# Altium project Kurs_2025_1.PrjPcb
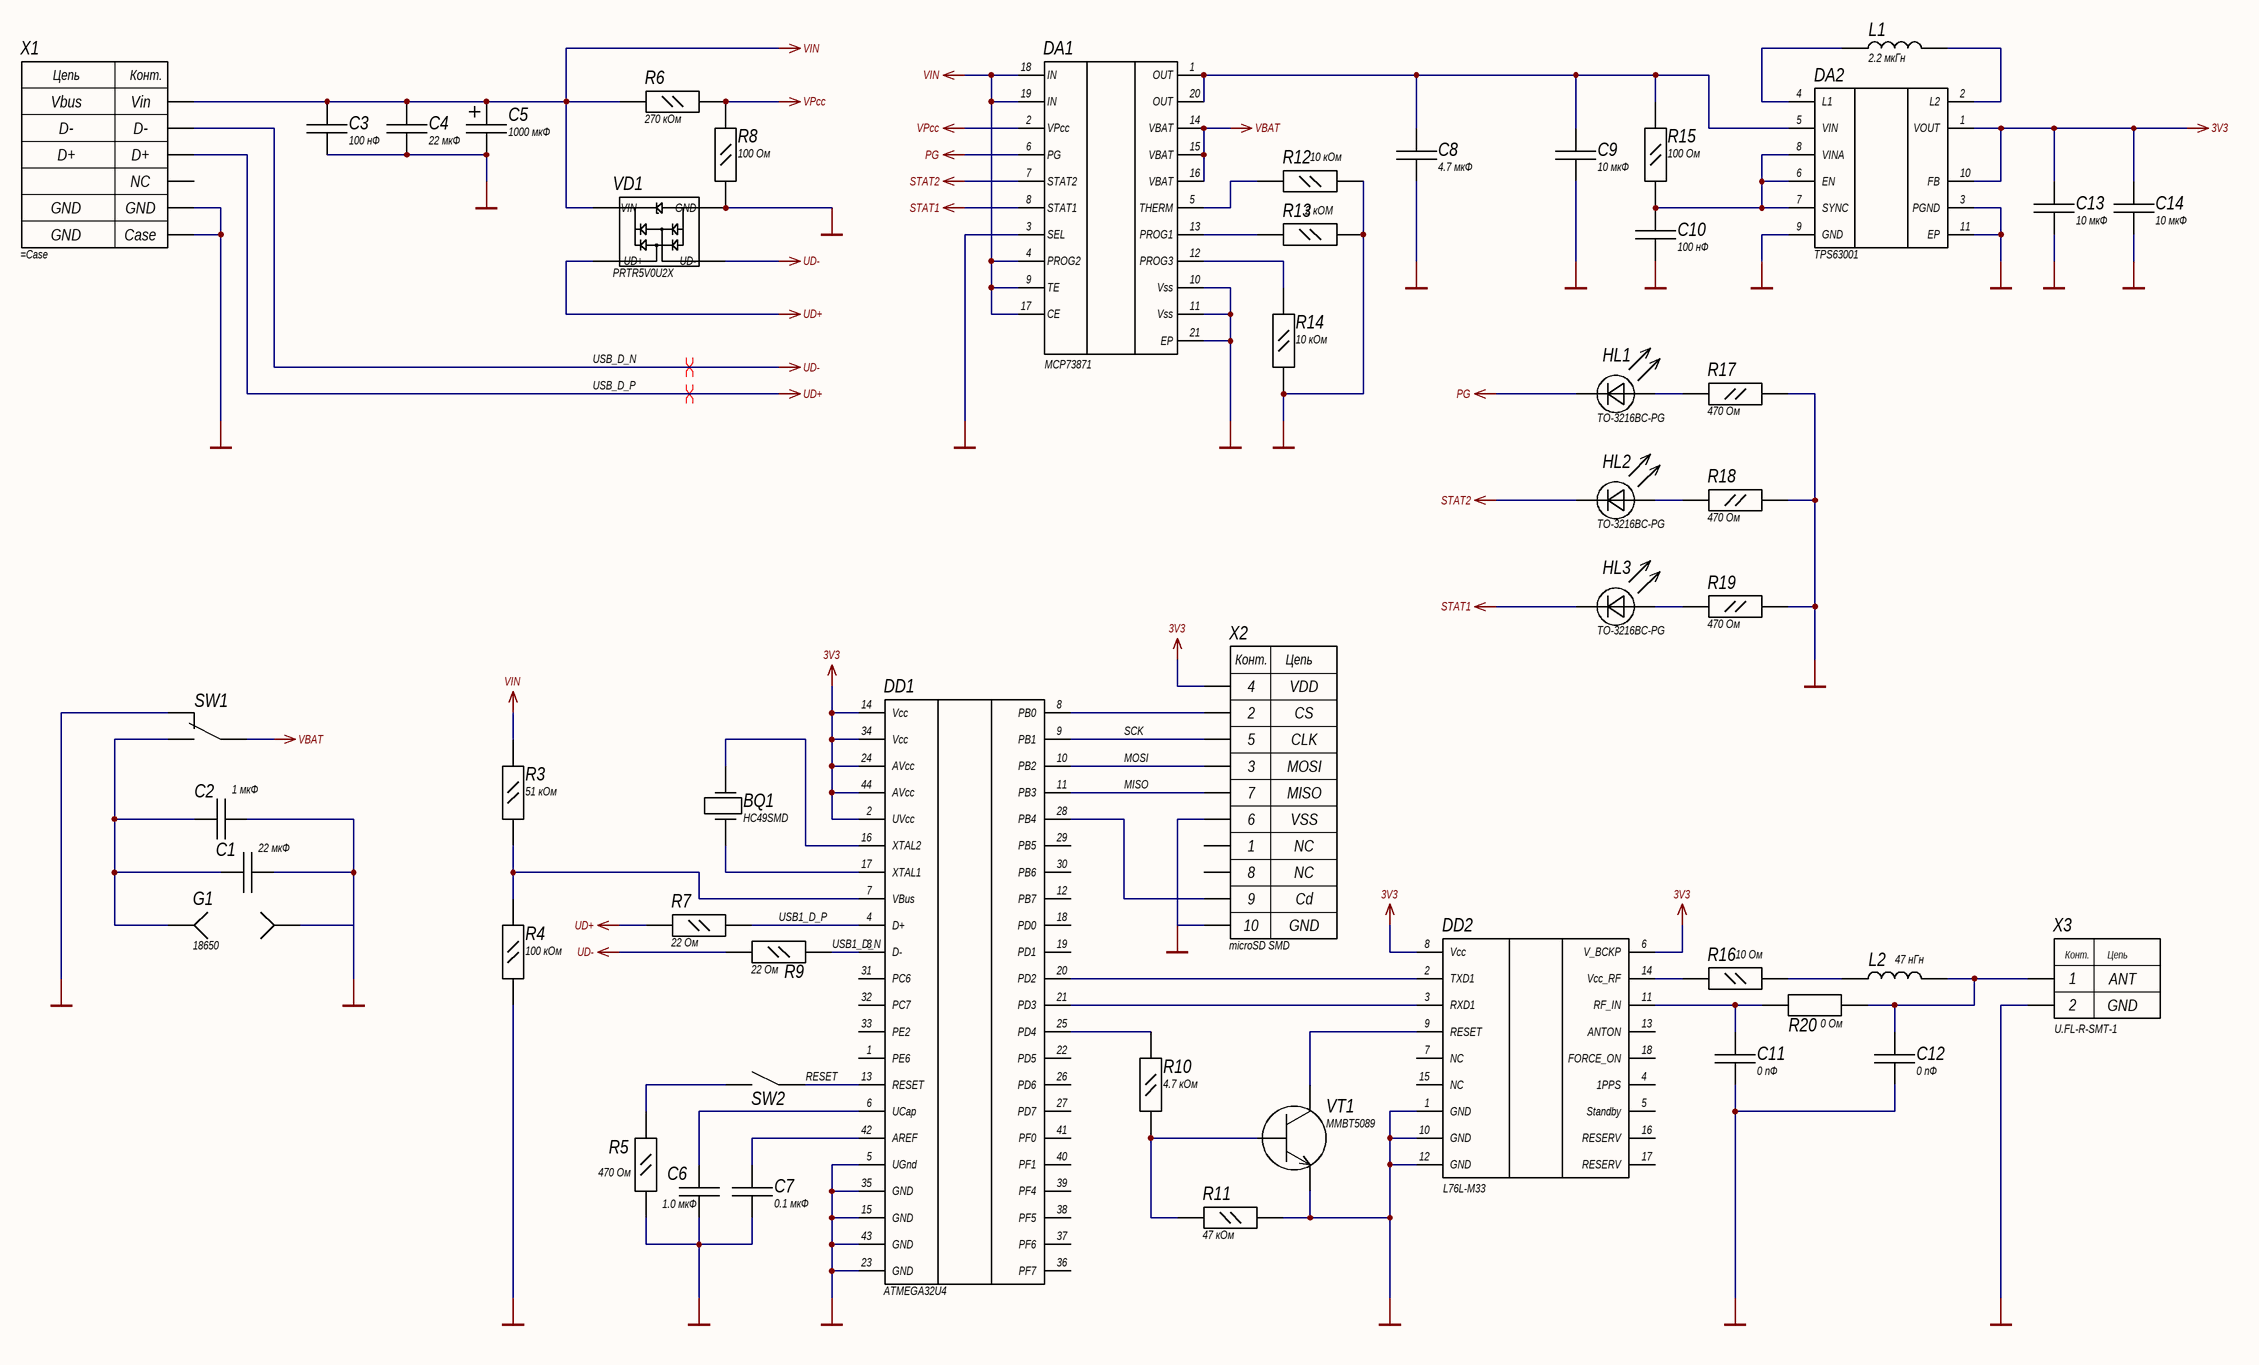
[diagram p0: Schema.SchDoc]
1 sheet, 50 parts. Net scope: global (net labels, ports and power ports of the same name join across sheets).
Board file: PCB.PcbDoc

## Sheet Schema.SchDoc
size A2; SheetNumber: 1; SheetTotal: 1

### Parts
BQ1  HC49SMD  [HC49SMD]
C1  22 мкФ  [CC0805]
C2  1 мкФ  [CC0805]
C3  100 нФ  [CC0805]
C4  22 мкФ  [CC0805]
C5  1000 мкФ  [SMD_CAP_10x10.5]
C6  1.0 мкФ  [CC0805]
C7  0.1 мкФ  [CC0805]
C8  4.7 мкФ  [CC0805]
C9  10 мкФ  [CC0805]
C10  100 нФ  [CC0805]
C11  0 пФ  [CC0805_0]
C12  0 пФ  [CC0805_0]
C13  10 мкФ  [CC0805]
C14  10 мкФ  [CC0805]
DA1  MCP73871  [QFN-20]
DA2  TPS63001  [VSON10]
DD1  ATMEGA32U4  [TQFP-44]
DD2  L76L-M33  [L76-M33]
G1  18650  [KLS5-18650]
HL1  TO-3216BC-PG  [LED_1206_Green]
HL2  TO-3216BC-PG  [LED_1206_Green]
HL3  TO-3216BC-PG  [LED_1206_Green]
L1  2.2 мкГн  [SMD-CDSP43]
L2  47 нГн  [0402]
R3  51 кОм  [RC0805]
R4  100 кОм  [RC0805]
R5  470 Ом  [RC0805]
R6  270 кОм  [RC0805]
R7  22 Ом  [RC0805]
R8  100 Ом  [RC0805]
R9  22 Ом  [RC0805]
R10  4.7 кОм  [RC0805]
R11  47 кОм  [RC0805]
R12  10 кОм  [RC0805]
R13  2 кОМ  [RC0805]
R14  10 кОм  [RC0805]
R15  100 Ом  [RC0805]
R16  10 Ом  [RC0805]
R17  470 Ом  [RC0805]
R18  470 Ом  [RC0805]
R19  470 Ом  [RC0805]
R20  0 Ом  [RC0805_0]
SW1  SPDT_Switch  [SPDT-Horizontal]  (value not drawn)
SW2  SW  [6x6_SMD]  (value not drawn)
VD1  PRTR5V0U2X  [SOT143]
VT1  MMBT5089  [SOT23]
X1  (no value)  [USB-B-micro]
X2  microSD SMD  [microSD-SMD]
X3  U.FL-R-SMT-1  [U.FL-R-SMT-1]

### Nets
3V3: C13.1 C14.1 DA2.1(VOUT) DA2.10(FB) DD1.2(UVcc) DD1.14(Vcc) DD1.24(AVcc) DD1.34(Vcc) DD1.44(AVcc) DD2.6(V_BCKP) DD2.8(Vcc) X2.4
GND: C1.2 C2.2 C3.2 C4.2 C5.1 C6.2 C7.2 C8.2 C9.2 C10.2 C11.2 C12.2 C13.2 C14.2 DA1.3(SEL) DA1.10(Vss) DA1.11(Vss) DA1.21(EP) DA2.3(PGND) DA2.9(GND) DA2.11(EP) DD1.5(UGnd) DD1.15(GND) DD1.23(GND) DD1.35(GND) DD1.43(GND) DD2.1(GND) DD2.10(GND) DD2.12(GND) G1.Minus R4.2 R5.1 R8.1 R11.1 R12.1 R13.1 R14.1 R17.2 R18.2 R19.2 SW1.NC VD1.1(GND) VT1.2(E) X1.5(Vin) X1.6 X2.6 X2.GND X3.2
PG: DA1.6(PG) HL1.K
STAT1: DA1.8(STAT1) HL3.K
STAT2: DA1.7(STAT2) HL2.K
USB_D_N: R9.2 VD1.2(UD-) X1.2(Vin)  [also labelled UD-]
USB_D_P: R7.2 VD1.3(UD+) X1.3(Vin)  [also labelled UD+]
VBAT: DA1.14(VBAT) DA1.15(VBAT) DA1.16(VBAT) SW1.COM
VIN: C3.1 C4.1 C5.2 DA1.4(PROG2) DA1.9(TE) DA1.17(CE) DA1.18(IN) DA1.19(IN) R3.1 R6.2 VD1.4(VIN) X1.1
VPcc: DA1.2(VPcc) R6.1 R8.2
MISO: DD1.11(PB3) X2.7
MOSI: DD1.10(PB2) X2.3
RESET: DD1.13(RESET) SW2.2
SCK: DD1.9(PB1) X2.5
USB1_D_N: DD1.3(D-) R9.1
USB1_D_P: DD1.4(D+) R7.1
NetBQ1_1: BQ1.1 DD1.17(XTAL1)
NetBQ1_2: BQ1.2 DD1.16(XTAL2)
NetC1_1: C1.1 C2.1 G1.Plus SW1.NO
NetC6_1: C6.1 DD1.6(UCap)
NetC7_1: C7.1 DD1.42(AREF)
NetC8_1: C8.1 C9.1 DA1.1(OUT) DA1.20(OUT) DA2.5(VIN) R15.1
NetC10_1: C10.1 DA2.6(EN) DA2.7(SYNC) DA2.8(VINA) R15.2
NetC11_1: C11.1 DD2.11(RF_IN) R20.2
NetC12_1: C12.1 L2.2 R20.1 X3.1
NetDA1_5: DA1.5(THERM) R12.2
NetDA1_12: DA1.12(PROG3) R14.2
NetDA1_13: DA1.13(PROG1) R13.2
NetDA2_2: DA2.2(L2) L1.2
NetDA2_4: DA2.4(L1) L1.1
NetDD1_7: DD1.7(VBus) R3.2 R4.1
NetDD1_8: DD1.8(PB0) X2.2
NetDD1_20: DD1.20(PD2) DD2.2(TXD1)
NetDD1_21: DD1.21(PD3) DD2.3(RXD1)
NetDD1_25: DD1.25(PD4) R10.2
NetDD1_28: DD1.28(PB4) X2.Cd
NetDD2_9: DD2.9(RESET) VT1.3(C)
NetDD2_14: DD2.14(Vcc_RF) R16.2
NetHL1_A: HL1.A R17.1
NetHL2_A: HL2.A R18.1
NetHL3_A: HL3.A R19.1
NetL2_1: L2.1 R16.1
NetR5_2: R5.2 SW2.1
NetR10_1: R10.1 R11.2 VT1.1(B)

Not connected (* = marked no-connect by the designer): DD1 1(PE6) 12(PB7) 18(PD0) 19(PD1) 22(PD5) 26(PD6) 27(PD7) 29(PB5) 30(PB6) 31(PC6) 32(PC7) 33(PE2) 36(PF7) 37(PF6) 38(PF5) 39(PF4) 40(PF1) 41(PF0); DD2 4(1PPS) 5(Standby) 7(NC) 13(ANTON) 15(NC) 16(RESERV) 17(RESERV) 18(FORCE_ON); X1 4(Vin); X2 1 8

### Layout directives
differential pair: USB_D_N, USB_D_P

### Notes on the sheet
- (in symbol 112J-TDAR-R01) Конт.; Цепь; VDD; CS; CLK; MOSI; MISO; VSS; NC
- (in symbol 10118194-0001LF) Цепь; Конт.; Vbus; D-; D+; NC; GND; Case
- (in symbol U.FL-R-SMT-1[80]) Конт.; Цепь; ANT; GND

### Library data of the parts
BQ1 = HC49SMD: Кварцевый резонатор , монтаж SMD; ValueManufacturer: RUICHI; ValueDescription: Кварцевый резонатор SMD 8 МГц 16 пФ ±20 ppm; Capacity: 16 пФ; Frequency: 8 МГц; Tolerance: 20 ppm; Temp: -20…+70 °С; Part Number: HC49SMD; IC_Name: HC49SMD; ValueType: Кварцевый резонатор; Case: SMD; Link: https://www.chipdip.ru/product/hc49smd-8-mhz-16pf-30ppm-kvartsevyy-rezonator-ruichi-8030745328
C1 C4 = GRM21BR61E226ME44L: безвыводные керамические неполярные конденсаторы общего применения; ValueManufacturer: Murata Electronics; ValueDescription: Конденсатор 0805 22 мкФ ±20% 25В; Tolerance: 20%; Voltage: 25В; Temp: -55…85; Part Number: GRM21BR61E226ME44L; ValueType: Конденсатор; Case: 0805; Link: https://www.chipdip.ru/product/22mkf-x5r-25v-20-0805-grm21br61e226me44l-kondensator-murata-9000272790; EffectiveValue: 22 мкФ
C2 = GRM21BR71H105KA12L: безвыводные керамические неполярные конденсаторы общего применения; ValueManufacturer: Murata Electronics; ValueDescription: Конденсатор 0805 1 мкФ ±10% 50В; Tolerance: 10%; Voltage: 50В; Temp: -55…125; Part Number: GRM21BR71H105KA12L; ValueType: Конденсатор; Case: 0805; Link: https://www.chipdip.ru/product/1-mkf-x7r-50v-10-0805-grm21br71h105k-kondensator-murata-9000059108; EffectiveValue: 1 мкФ
C3 C10 = CL21F104ZBCNNNC: безвыводные керамические неполярные конденсаторы общего применения; ValueManufacturer: Samsung Electronics; ValueDescription: Конденсатор 0805 100 нФ ±10% 50В; Tolerance: 10%; Voltage: 50В; Temp: -30…50; Part Number: CL21F104ZBCNNNC; ValueType: Конденсатор; Case: 0805; Link: https://www.chipdip.ru/product/cl21f104zbcnnnc-samsung-8001793788; EffectiveValue: 100 нФ
C5 = JCK1A102M100105: Алюминиевые электролитические конденсаторы; ValueManufacturer: JB Capacitors; ValueDescription: Конденсатор электролитический 10x10.5мм 1000 мкФ ±20% 50 В; ValueType: Конденсатор электролитический; Tolerance: 20%; Voltage: 50 В; Temp: -40…105; Part Number: JCK1A102M100105; Case: 10x10.5мм; Link: https://www.chipdip.ru/product/ecap-smd-1000mkf-10v-105-c-20-10x10.5mm-jb-capacitors-9000565753; EffectiveValue: 1000 мкФ
C6 = GRM21BR71C105KA01K: ValueManufacturer: Murata Electronics; ValueDescription: Конденсатор 0805 1.0 мкФ ±10% 50В; ValueType: Конденсатор; Tolerance: 10%; Voltage: 50В; Temp: -55…125; Part Number: GRM21BR71C105KA01K; Case: 0805; Link: https://www.chipdip.ru/product/grm21br71c105k; EffectiveValue: 1.0 мкФ
C7 = GRM21BR71H104K: ValueManufacturer: Murata Electronics; ValueDescription: Конденсатор 0805 0.1 мкФ ±10% 50В; ValueType: Конденсатор; Tolerance: 10%; Voltage: 50В; Temp: -55…125; Part Number: GRM21BR71H104K; Case: 0805; Link: https://www.chipdip.ru/product/grm21br71h104k; EffectiveValue: 0.1 мкФ
C8 = GRM21BR61A475KA73L: безвыводные керамические неполярные конденсаторы общего применения; ValueManufacturer: Murata Electronics; ValueDescription: Конденсатор 0805 4.7 мкФ ±10% 10В; Tolerance: 10%; Voltage: 10В; Temp: -55…85; Part Number: GRM21BR61A475KA73L; ValueType: Конденсатор; Case: 0805; Link: https://www.chipdip.ru/product/4.7-mkf-x5r-10-10v-0805-grm21br61a475ka73l-murata-9000122610; EffectiveValue: 4.7 мкФ
C9 C13 C14 = GRM21BR61H106KE43L: безвыводные керамические неполярные конденсаторы общего применения; ValueManufacturer: Murata Electronics; ValueDescription: Конденсатор 0805 10 мкФ ±10% 50В; Tolerance: 10%; Voltage: 50В; Temp: -55…125; Part Number: GRM21BR61H106KE43L; ValueType: Конденсатор; Case: 0805; Link: https://www.chipdip.ru/product/10mkf-x5r-50v-10-0805-grm21br61h106ke43l-kondensator-murata-9000665990; EffectiveValue: 10 мкФ
C11 C12 = 0F: Перемычка; Part Number: 0F; EffectiveValue: 0 пФ
DA1 = MCP73871-2CCI/ML: The MCP73871-2CCI/ML is a stand-alone system load sharing and Li-ion/Li-polymer battery charge Management Controller with AC-DC wall adapter and USB port power sources selection; ValueManufacturer: Microchip Technology; ValueDescription: Драйвер зарядки MCP73871; ValueType: Драйвер зарядки; Part Number: MCP73871-2CCI/ML; Case: QFN-20; Link: https://www.chipdip.ru/product/mcp73871-2cci-ml-battery-management-usb-ac-microchip-8005459712; IC_Name: MCP73871
DA2 = TPS63001DRCR: Преобразователь постоянного тока понижающий-повышающий синхронный 3.3В; ValueManufacturer: Texas Instruments; ValueDescription: Преобразователь постоянного тока TPS63001; Part Number: TPS63001DRCR; ValueType: Преобразователь постоянного тока; Case: VSON10; Link: https://www.chipdip.ru/product/tps63001drcr-texas-instruments-8033558615; IC_Name: TPS63001
DD1 = ATMEGA32U4-AU: ValueManufacturer: Microchip Technology; ValueDescription: Микроконтроллер 8-Бит, AVR ATMEGA32U4; ValueType: Микроконтроллер 8-Бит, AVR; Part Number: ATMEGA32U4-AU; Case: TQFP-44; Link: https://www.chipdip.ru/product/atmega32u4-au; IC_Name: ATMEGA32U4
DD2 = L76L-M33: GPS/GLONAS модуль; ValueManufacturer: Quectel; ValueDescription: GPS/GLONAS модуль L76L-M33; Part Number: L76L-M33; ValueType: GPS/GLONAS модуль; Case: L76L-M33; Link: https://www.chipdip.ru/product/l76l-m33-quectel-8002892233; IC_Name: L76L-M33
G1 = KLS5-18650-006: Держатели батарей, клипсы, контакты; ValueManufacturer: KLS electronic co ltd; ValueDescription: Держатель батареи --; ValueType: Держатель батареи; Part Number: KLS5-18650-006; Case: 18650; Link: https://www.chipdip.ru/product/kls5-18650-d-batareynyy-otsek-1x18650-na-platu-9000597333; IC_Name: --
HL1-HL3 = 9203T013: ValueManufacturer: Taiwan Oasis Technology Co., Ltd; ValueDescription: Светодиод зеленый SMD 3216 TO-3216BC-PG; ValueType: Светодиод; Color: зеленый; Part Number: 9203T013; Case: SMD 3216; Link: https://www.chipdip.ru/product/to-3216bc-pg; IC_Name: TO-3216BC-PG
L1 = CDSP43-2R2M: =ValueType+' '+EffectiveValue+' ±'+Tolerance; ValueManufacturer: SCE; ValueDescription: Индуктивность, SMD 2.2 мкГн ±20%; ValueType: Индуктивность, SMD; Tolerance: 20%; Temp: -40…125 / -40...125; Part Number: CDSP43-2R2M; Link: https://www.chipdip.ru/product/cdsp43-2r2m-2.2mkgn-induktivnost-smd-sce-9001493377; EffectiveValue: 2.2 мкГн
L2 = LQW15AN47NJ00D: High quality coil inductors designed for VHF and UHF applications; ValueManufacturer: Murata Electronics; ValueDescription: Индуктивность, SMD 47 нГн ±5%; ValueType: Индуктивность, SMD; Tolerance: 5%; Part Number: LQW15AN47NJ00D; Link: https://www.chipdip.ru/product/lqw15an47nj00d-47-ngn-0402-5-induktivnost-smd-murata-9000127414; EffectiveValue: 47 нГн
R3 = RC0805FR-0751KL: ValueManufacturer: No trademark; ValueDescription: Резистор 0805 51 кОм ±1% 0.125Вт; ValueType: Резистор; Power: 0.125Вт; Tolerance: 1%; Voltage: 150В; Temp: -55…155; Part Number: RC0805FR-0751KL; Case: 0805; Link: https://www.chipdip.ru/product/0.125vt-0805-51-kom-1-chip-rezistor-smd-9000079531; EffectiveValue: 51 кОм
R4 = RC0805FR-07100KL: ValueManufacturer: No trademark; ValueDescription: Резистор 0805 100 кОм ±1% 0.125Вт; ValueType: Резистор; Power: 0.125Вт; Tolerance: 1%; Voltage: 150В; Temp: -55…155; Part Number: RC0805FR-07100KL; Case: 0805; Link: https://www.chipdip.ru/product/0.125w-0805-100-kom-1; EffectiveValue: 100 кОм
R5 R17-R19 = RC0805FR-07470RL: ValueManufacturer: No trademark; ValueDescription: Резистор 0805 470 Ом ±1% 0.125Вт; ValueType: Резистор; Power: 0.125Вт; Tolerance: 1%; Voltage: 150В; Temp: -55…155; Part Number: RC0805FR-07470RL; Case: 0805; Link: https://www.chipdip.ru/product/0.125w-0805-470-om-1; EffectiveValue: 470 Ом
R6 = RC0805FR-07270KL: ValueManufacturer: No trademark; ValueDescription: Резистор 0805 270 кОм ±1% 0.125Вт; ValueType: Резистор; Power: 0.125Вт; Tolerance: 1%; Voltage: 150В; Temp: -55…155; Part Number: RC0805FR-07270KL; Case: 0805; Link: https://www.chipdip.ru/product/0.125w-0805-270-kom-1; EffectiveValue: 270 кОм
R7 R9 = RC0805FR-0722RL: ValueManufacturer: No trademark; ValueDescription: Резистор 0805 22 Ом ±1% 0.125Вт; ValueType: Резистор; Power: 0.125Вт; Tolerance: 1%; Voltage: 150В; Temp: -55…155; Part Number: RC0805FR-0722RL; Case: 0805; Link: https://www.chipdip.ru/product/0.125vt-0805-22-om-1-chip-rezistor-smd-9000079446; EffectiveValue: 22 Ом
R8 R15 = RC0805FR-07100RL: ValueManufacturer: No trademark; ValueDescription: Резистор 0805 100 Ом ±1% 0.125Вт; ValueType: Резистор; Power: 0.125Вт; Tolerance: 1%; Voltage: 150В; Temp: -55…155; Part Number: RC0805FR-07100RL; Case: 0805; Link: https://www.chipdip.ru/product/0.125w-0805-100-om-1; EffectiveValue: 100 Ом
R10 = RC0805FR-074K7L: ValueManufacturer: No trademark; ValueDescription: Резистор 0805 4.7 кОм ±1% 0.125Вт; ValueType: Резистор; Power: 0.125Вт; Tolerance: 1%; Voltage: 150В; Temp: -55…155; Part Number: RC0805FR-074K7L; Case: 0805; Link: https://www.chipdip.ru/product/0.125w-0805-4.7-kom-1; EffectiveValue: 4.7 кОм
R11 = RC0805FR-0747KL: ValueManufacturer: No trademark; ValueDescription: Резистор 0805 47 кОм ±1% 0.125Вт; ValueType: Резистор; Power: 0.125Вт; Tolerance: 1%; Voltage: 150В; Temp: -55…155; Part Number: RC0805FR-0747KL; Case: 0805; Link: https://www.chipdip.ru/product/0.125w-0805-47-kom-1; EffectiveValue: 47 кОм
R12 R14 = RC0805FR-0710KL: ValueManufacturer: No trademark; ValueDescription: Резистор 0805 10 кОм ±1% 0.125Вт; ValueType: Резистор; Power: 0.125Вт; Tolerance: 1%; Voltage: 150В; Temp: -55…155; Part Number: RC0805FR-0710KL; Case: 0805; Link: https://www.chipdip.ru/product/0.125w-0805-10-kom-1; EffectiveValue: 10 кОм
R13 = RC0805FR-072KL: ValueManufacturer: No trademark; ValueDescription: Резистор 0805 2 кОМ ±1% 0.125Вт; ValueType: Резистор; Power: 0.125Вт; Tolerance: 1%; Voltage: 150В; Temp: -55…155; Part Number: RC0805FR-072KL; Case: 0805; Link: https://www.chipdip.ru/product/0.125w-0805-2-kom-1; EffectiveValue: 2 кОМ
R16 = RC0805FR-0710RL: ValueManufacturer: No trademark; ValueDescription: Резистор 0805 10 Ом ±1% 0.125Вт; ValueType: Резистор; Power: 0.125Вт; Tolerance: 1%; Voltage: 150В; Temp: -55…155; Part Number: RC0805FR-0710RL; Case: 0805; Link: https://www.chipdip.ru/product/0.125vt-0805-10-om-1-chip-rezistor-smd-9000079936; EffectiveValue: 10 Ом
R20 = 0 Ohm: 0 Ом перемычка; Part Number: 0 Ohm; EffectiveValue: 0 Ом
SW1 = 500SSP1S1M6QEA: =ValueType+' '+Case; ValueManufacturer: E-Switch; ValueDescription: Переключатель движковый SPDT; ValueType: Переключатель движковый; Part Number: 500SSP1S1M6QEA; Case: SPDT; Link: https://www.chipdip.ru/product/500ssp1s1m6qea-pereklyuchatel-dvizhkovyy-pol-2-e-switch-8021935358
SW2 = L-KLS7-TS6604-5.0-180-B: Кнопка тактильная 6х6мм h=5мм усилие нажатия 180гр SMD монтаж россыпь; ValueManufacturer: KLS electronic co ltd; ValueDescription: Кнопка тактильная 6х6мм SPST; Part Number: L-KLS7-TS6604-5.0-180-B; ValueType: Кнопка тактильная 6х6мм; Case: SPST; Link: https://www.chipdip.ru/product/kls7-ts6604-5.0-180-it-1102sa-knopka-taktovaya-6x6x5mm-9000336848
VD1 = PRTR5V0U2X: Диоды для подавления переходных скачков напряжения для подавления переходных скачков напряжения 5.5V DUAL R-R ESD ULTRA LOW CAP; ValueManufacturer: Nexperia B.V. / Nexperia B.V.; ValueDescription: Подавитель статического заряда PRTR5V0U2X; ValueType: Подавитель статического заряда; Part Number: PRTR5V0U2X; Case: SOT-143B; Link: https://www.chipdip.ru/product/prtr5v0u2x-215-podaviteli-staticheskogo-zaryada-nexperia-9000088547; IC_Name: PRTR5V0U2X
VT1 = MMBT5089: Аналог КТ3102Е; ValueManufacturer: Shikues; ValueDescription: NPN-транзистор MMBT5089; ValueType: NPN-транзистор; Part Number: MMBT5089; Case: SOT23; Link: https://www.chipdip.ru/product0/8003371769; IC_Name: MMBT5089
X1 = 10118194-0001LF: USB - micro B USB 2.0 Receptacle Connector 5 Position Surface Mount, Right Angle; Through Hole; ValueManufacturer: Amphenol ICC (FCI); ValueDescription: Разъем Micro-USB B; ValueType: Разъем; IC_Name: Micro-USB B; Part Number: 10118194-0001LF; Link: https://www.chipdip.ru/product/10118194-0001lf-gnezdo-usb-b-micro-na-pcb-smt-tht-amphenol-8032862677; System: Connector
X2 = 112J-TDAR-R01: Держатель micro SD карты SMD 8 pin; ValueManufacturer: ATTEND TECHNOLOGY; ValueDescription: Держатель microSD MicroSD SMD holder; IC_Name: MicroSD SMD holder; System: Connector; Part Number: 112J-TDAR-R01; ValueType: Держатель microSD; Case: microSD SMD; Link: https://www.chipdip.ru/product/112j-tdar-r01-112j-tdar-r01-r3-microsd-soket-attend-8003294753
X3 = U.FL-R-SMT-1[80]: Разъем UFL 50 Ом на плату SMT; ValueManufacturer: Hirose Connector; ValueDescription: Разъем U.FL-R-SMT-1; System: Connector; Part Number: U.FL-R-SMT-1[80]; ValueType: Разъем; Case: SMT-1; Link: https://www.chipdip.ru/product/u-fl-r-smt-1-u-fl-r-smt-1-80-razem-ufl-50-om-na-hirose-9000586248?from=suggest_product; IC_Name: U.FL-R-SMT-1